# Altium schematic sheet USB2JTAG-Power.SchDoc: =ProjectTitle+'-Power'
size A4; SheetNumber: 3; SheetTotal: 3
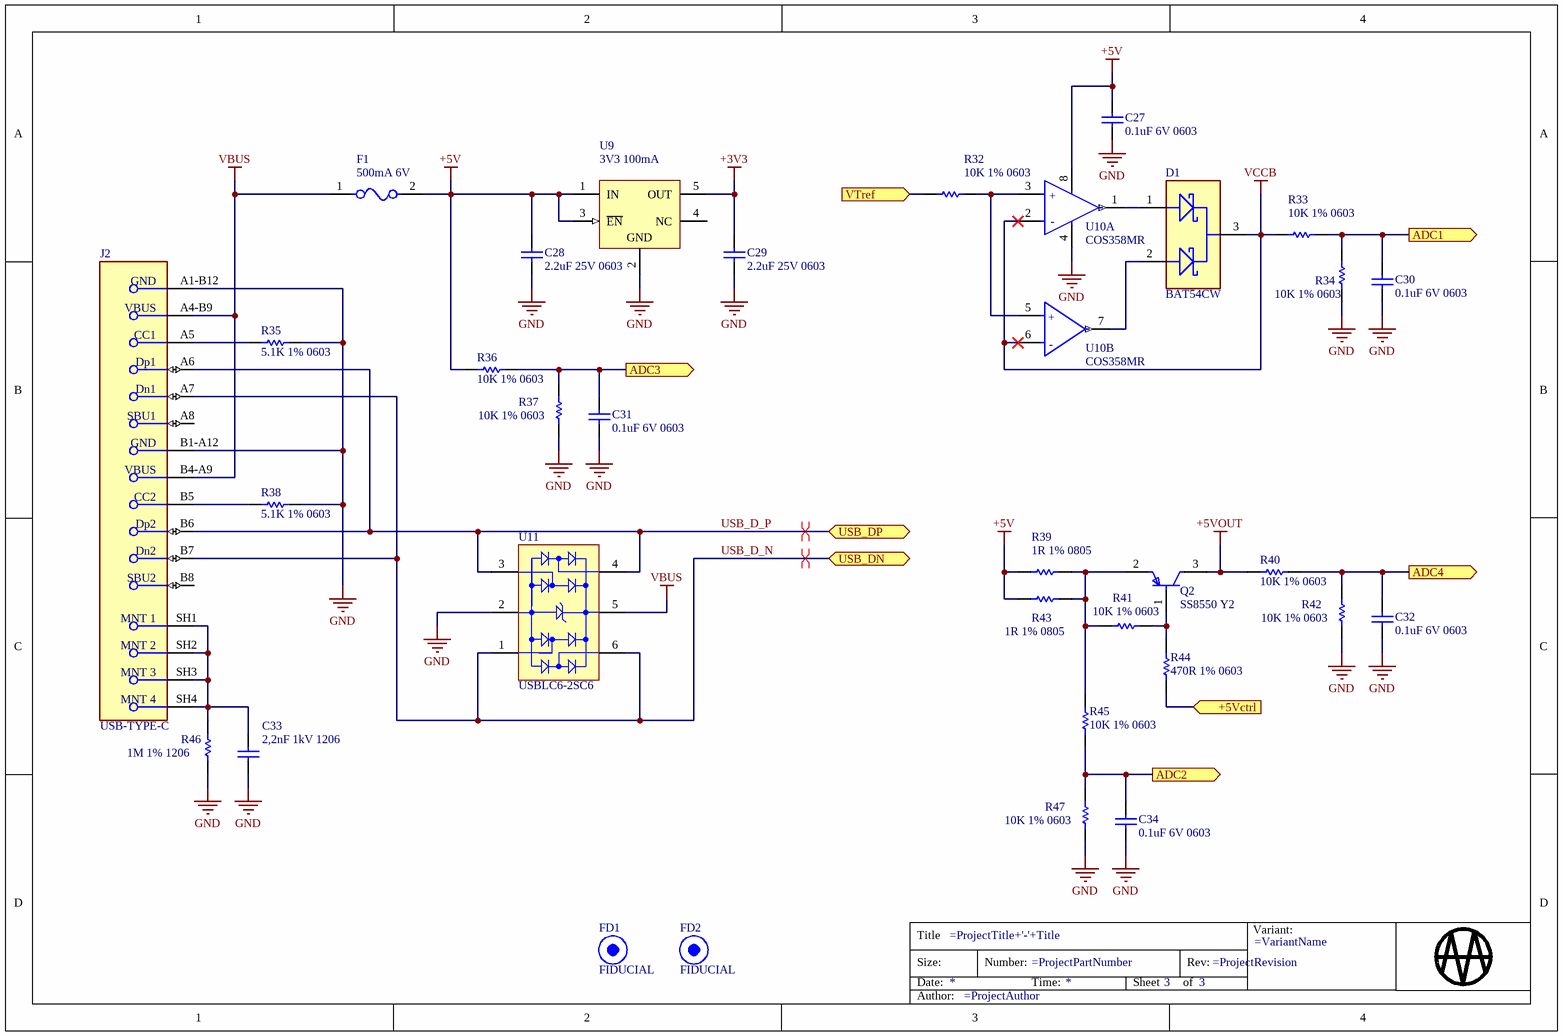
[diagram p0: USB2JTAG-Power.SchDoc]

## Parts
?  Total Sheets: 3  (hidden comment: Title Block Logo)  (graphical)
C27  0.1uF 6V 0603  [FP-GRM188-0_1-e0_2_0_55-IPC_C-NOSILK]
C28  2.2uF 25V 0603  [FP-GRM188-0_1-e0_2_0_55-IPC_C-NOSILK]
C29  2.2uF 25V 0603  [FP-GRM188-0_1-e0_2_0_55-IPC_C-NOSILK]
C30  0.1uF 6V 0603  [FP-GRM188-0_1-e0_2_0_55-IPC_C-NOSILK]
C31  0.1uF 6V 0603  [FP-GRM188-0_1-e0_2_0_55-IPC_C-NOSILK]
C32  0.1uF 6V 0603  [FP-GRM188-0_1-e0_2_0_55-IPC_C-NOSILK]
C33  2,2nF 1kV 1206  [FP-C3216-160-0_2-IPC_B-NOSILK]
C34  0.1uF 6V 0603  [FP-GRM188-0_1-e0_2_0_55-IPC_C-NOSILK]
D1  BAT54CW  [FP-SOT323-IPC_B]
F1  500mA 6V  [FP-0805L-MFG]
FD1  FIDUCIAL  [FIDUCIAL_2MM]  (no BOM)
FD2  FIDUCIAL  [FIDUCIAL_2MM]  (no BOM)
J2  USB-TYPE-C  [KH-TYPE-C-16P-2]
Q2  SS8550 Y2  [FP-SOT-23-IPC_B]
R32  10K 1% 0603  [FP-ERA3A-IPC_C-NOSILK]
R33  10K 1% 0603  [FP-ERA3A-IPC_C-NOSILK]
R34  10K 1% 0603  [FP-ERA3A-IPC_C-NOSILK]
R35  5.1K 1% 0603  [FP-ERA3A-IPC_C-NOSILK]
R36  10K 1% 0603  [FP-ERA3A-IPC_C-NOSILK]
R37  10K 1% 0603  [FP-ERA3A-IPC_C-NOSILK]
R38  5.1K 1% 0603  [FP-ERA3A-IPC_C-NOSILK]
R39  1R 1% 0805  [FP-RC0805-0_6-IPC_B-NOSILK]
R40  10K 1% 0603  [FP-ERA3A-IPC_C-NOSILK]
R41  10K 1% 0603  [FP-ERA3A-IPC_C-NOSILK]
R42  10K 1% 0603  [FP-ERA3A-IPC_C-NOSILK]
R43  1R 1% 0805  [FP-RC0805-0_6-IPC_B-NOSILK]
R44  470R 1% 0603  [FP-ERA3A-IPC_C-NOSILK]
R45  10K 1% 0603  [FP-ERA3A-IPC_C-NOSILK]
R46  1M 1% 1206  [FP-RC1206-IPC_B]
R47  10K 1% 0603  [FP-ERA3A-IPC_C-NOSILK]
U9  3V3 100mA  [DBV0005A_N]
U10  COS358MR  [MSOP-8]  (parts A,B of 2)
U11  USBLC6-2SC6  [STM-SOT23-6L_V]

## Ports
+5Vctrl (in), ADC1 (out), ADC2 (out), ADC3 (out), ADC4 (out), USB_DN (bidir), USB_DP (bidir), VTref (in)

## Nets
+3V3: C29.1 U9.5(OUT)
+5V: C27.1 C28.1 F1.2 R36.2 R39.2 R43.2 U9.1(IN) U9.3(~{EN}) U10.8(V+)
+5VOUT: Q2.3(C) R40.2
GND: C27.2 C28.2 C29.2 C30.2 C31.2 C32.2 C33.2 C34.2 J2.A1-B12(GND) J2.B1-A12(GND) R34.2 R35.1 R37.2 R38.1 R42.2 R46.2 R47.2 U9.2(GND) U10.4(V-) U11.2(GND)
VBUS: F1.1 J2.A4-B9(VBUS) J2.B4-A9(VBUS) U11.5(VBUS)
VCCB: D1.3(COMMON_CATHODE) R33.2 U10.2(IN1-) U10.6(IN2-)
+5Vctrl: R44.1 ; port +5Vctrl
ADC1: C30.1 R33.1 R34.1 ; port ADC1
ADC2: C34.1 R45.1 R47.1 ; port ADC2
ADC3: C31.1 R36.1 R37.1 ; port ADC3
ADC4: C32.1 R40.1 R42.1 ; port ADC4
USB_D_N: J2.A7(Dn1) J2.B7(Dn2) U11.1(I/O_1) U11.6(I/O_4) ; port USB_DN
USB_D_P: J2.A6(Dp1) J2.B6(Dp2) U11.3(I/O_2) U11.4(I/O_3) ; port USB_DP
VTref: R32.2 ; port VTref
NetC33_1: C33.1 J2.SH1 J2.SH2 J2.SH3 J2.SH4 R46.1
NetD1_1: D1.1(1_ANODE) U10.1(OUT1)
NetD1_2: D1.2(2_ANODE) U10.7(OUT2)
NetJ2_A5: J2.A5(CC1) R35.2
NetJ2_B5: J2.B5(CC2) R38.2
NetQ2_1: Q2.1(B) R41.2 R44.2
NetQ2_2: Q2.2(E) R39.1 R41.1 R43.1 R45.2
NetR32_1: R32.1 U10.3(IN1+) U10.5(IN2+)

Not connected (* = marked no-connect by the designer): J2 A8(SBU1) B8(SBU2); U9 4(NC)

## Layout directives
differential pair: USB_D_N, USB_D_P

## Notes on the sheet
- Title
- Size:
- Date:
- A4
- Number:
- Time:
- Revision:
- Sheet
- of
- File:
- (in symbol OPAMP 2 CIRCUIT, part A) +; -
- (in symbol OPAMP 2 CIRCUIT, part B) +; -
- (in symbol Title Block MAA) Variant:; Title; Size:; Number:; Rev:; Date:; Time:; Sheet; of; Author:
- (in symbol USB-TYPE-C) MNT 1; MNT 2; MNT 3; MNT 4

## Library data of the parts
? = Title Block MAA: Sheet Title: =ProjectTitle+'-'+Title; Document Number: =ProjectPartNumber; Revision Number: =ProjectRevision; Organization Address 1: =VariantName; Date: *; Time: *; Document Path and Name: =ProjectAuthor; Sheet Number: 3
C27 C30-C32 C34 = CAP0603: 50V 100nF X7R ±5% 0603 Multilayer Ceramic Capacitors MLCC - SMD/SMT ROHS; Manufacturer: Walsin Tech Corp; Manufacturer Part Number: 0603B104J500CT; Supplier 1: LCSC; Supplier Part Number 1: C119027; Case/Package: 0603
C28 C29 = CAP0603: 25V 2.2uF X7R ±10% 0603 Multilayer Ceramic Capacitors MLCC - SMD/SMT ROHS; Manufacturer: FH(Guangdong Fenghua Advanced Tech); Manufacturer Part Number: 0603B225K250NT; Supplier 1: LCSC; Supplier Part Number 1: C99228; Case/Package: 0603
  C28: ComponentLink1Description: Datasheet; ComponentLink1URL: *
C33 = CAP1206: 1kV 2.2nF X7R ±10% 1206  Multilayer Ceramic Capacitors MLCC - SMD/SMT ROHS; Manufacturer: FH (Guangdong Fenghua Advanced Tech); Manufacturer Part Number: 1206B222K102NT; Supplier 1: LCSC; Supplier Part Number 1: C9191; Case/Package: 1206; ComponentLink1Description: Datasheet; ComponentLink1URL: https://datasheet.lcsc.com/lcsc/1811151146_FH--Guangdong-Fenghua-Advanced-Tech-1206B222K102NT_C9191.pdf
D1 = CMP-12790-000028-1: 30V 1V@100mA 200mA SOT-323(SC-70) Schottky Barrier Diodes (SBD) ROHS; Manufacturer: Jiangsu Changjing Electronics Technology Co., Ltd.; Manufacturer Part Number: BAT54CW; Supplier 1: LCSC; Supplier Part Number 1: C77321; Case/Package: SOT-323; ComponentLink1Description: Datasheet; ComponentLink1URL: https://datasheet.lcsc.com/lcsc/1811122015_Jiangsu-Changjing-Electronics-Technology-Co---Ltd--BAT54CW_C77321.pdf
F1 = CMP-08606-000023-1: 6V 500mA 100A 1A 100ms 0805 Resettable Fuses ROHS; Manufacturer Part Number: SMD0805B050TF; Manufacturer: Brightking; Supplier 1: LCSC; Supplier Part Number 1: C269104; Case/Package: 0805; ComponentLink1Description: Datasheet; ComponentLink1URL: https://datasheet.lcsc.com/lcsc/1808280424_Brightking-SMD0805B050TF_C269104.pdf
J2 = USB-TYPE-C: CONN USB 2.0 TYPE-C R/A SMT; Manufacturer: Shenzhen Kinghelm Elec; Manufacturer Part Number: KH-TYPE-C-16P; Number Of Contacts: 16; ComponentLink2URL: https://datasheet.lcsc.com/lcsc/2009111434_Shenzhen-Kinghelm-Elec-KH-TYPE-C-16P_C709357.pdf; ComponentLink2Description: Datasheet; Supplier 1: LCSC; Supplier Part Number 1: C709357
Q2 = CMP-56214-000002-1: 100nA 25V 300mW 1.5A 200@100mA,1V 100MHz 500mV@800mA,80mA PNP +150℃@(Tj) SOT-23(SOT-23-3) Bipolar Transistors - BJT ROHS; Manufacturer: JCST; Case/Package: SOT-23; Supplier 1: LCSC; Supplier Part Number 1: C8542; Manufacturer Part Number: SS8550 Y2; ComponentLink1Description: datasheet; ComponentLink1URL: https://datasheet.lcsc.com/lcsc/1810161212_Jiangsu-Changjing-Electronics-Technology-Co---Ltd--SS8550-Y2_C8542.pdf
R32-R34 R36 R37 R40-R42 R45 R47 = RES0603: 0.1W ±1% 10kΩ 0603 Chip Resistor - Surface Mount ROHS; Manufacturer: TyoHM; Manufacturer Part Number: RMC 0603 10K F N; Case/Package: 0603; Supplier 1: LCSC; Supplier Part Number 1: C269701
  R34 R41: ComponentLink1Description: Datasheet; ComponentLink1URL: https://datasheet.lcsc.com/lcsc/1811101830_TyoHM-RMC-0603-10K-F-N_C269701.pdf
R35 R38 = RES0603: 100mW Thick Film Resistors 75V ±1% ±100ppm/℃ 5.1kΩ -55℃~+155℃ 0603 Chip Resistor - Surface Mount ROHS; Manufacturer: YAGEO; Manufacturer Part Number: RC0603FR-075K1L; Case/Package: 0603; Supplier 1: LCSC; Supplier Part Number 1: C105580
  R38: ComponentLink1Description: Datasheet; ComponentLink1URL: https://datasheet.lcsc.com/lcsc/1808272258_YAGEO-RC0603FR-075K1L_C105580.pdf
R39 R43 = RES0805: 125mW Thick Film Resistors 150V ±1% ±400ppm/℃ -55℃~+155℃ 1Ω 0805 Chip Resistor - Surface Mount ROHS; Manufacturer Part Number: 0805W8F100KT5E; Manufacturer: UNI-ROYAL(Uniroyal Elec); Supplier 1: LCSC; Supplier Part Number 1: C25271; Case/Package: 0805
  R39: ComponentLink1Description: Datasheet; ComponentLink1URL: https://datasheet.lcsc.com/lcsc/2205311845_UNI-ROYAL-Uniroyal-Elec-0805W8F100KT5E_C25271.pdf
R44 = RES0603: 100mW 75V ±100ppm/℃ ±1% -55℃~+155℃ 470Ω 0603 Chip Resistor - Surface Mount ROHS; Manufacturer: YAGEO; Manufacturer Part Number: RC0603FR-07470RL; Case/Package: 0603; Supplier 1: LCSC; Supplier Part Number 1: C114669; ComponentLink1Description: Datasheet; ComponentLink1URL: https://datasheet.lcsc.com/lcsc/1810161617_YAGEO-RC0603FR-07470RL_C114669.pdf
R46 = RES1206: 250mW Thick Film Resistors 200V ±1% ±100ppm/℃ -55℃~+155℃ 1MΩ 1206 Chip Resistor - Surface Mount ROHS; Manufacturer: YAGEO; Manufacturer Part Number: RC1206FR-071ML; Supplier 1: LCSC; Supplier Part Number 1: C108083; Case/Package: 1206; ComponentLink1Description: Datasheet; ComponentLink1URL: https://datasheet.lcsc.com/lcsc/1808272252_YAGEO-RC1206FR-071ML_C108083.pdf
U9 = CMP-0394-00641-2: 350mA 320mV@(200mA) Fixed 3.3V~3.3V Positive 1 18V SOT-23-5 Linear Voltage Regulators (LDO) ROHS; Manufacturer: MICRONE(Nanjing Micro One Elec); Manufacturer Part Number: ME6215C33M5G; ComponentLink2URL: https://datasheet.lcsc.com/lcsc/1809201023_MICRONE-Nanjing-Micro-One-Elec-ME6215C33M5G_C84119.pdf; ComponentLink2Description: datasheet; Supplier 1: LCSC; Supplier Part Number 1: C84119; Case/Package: SOT-23-5
U10 = OPAMP 2 CIRCUIT: IC OPAMP GP 2 CIRCUIT 8SOIC; Manufacturer: COSINE; Case/Package: MSOP-8; Manufacturer Part Number: COS358MR; Supplier 1: LCSC; Supplier Part Number 1: C693058; ComponentLink1Description: Datasheet; ComponentLink1URL: https://datasheet.lcsc.com/lcsc/2006301914_COSINE-COS358MR_C693058.pdf
U11 = CMP-2000-05378-1: Very low capacitance ESD protection, 3.5 pF, -40 to 125 degC, 6-Pin SOT23, RoHS, Tape and Reel; Manufacturer: STMicroelectronics; Polarity: Uni-Directional; Clamping Voltage: 17V; Rad Hardened: No; Product Height (mm): 1.3mm; Leakage Current (Max): 0.15uA; Product Length (mm): 3.05mm; Number of Elements: 1; Peak Pulse Current: 5A; Configuration: Dual; Reverse Breakdown Voltage: 6V; Working Voltage (Max): 5V; Capacitance Value: 3.5pF; Suppressor Type: DiodeArrays; Product Depth (mm): 1.75mm; Test Current (It): 1mA; Direction: Unidirectional,Bidirectional; Operating Supply Voltage: 1.1V; Number of Channels: 2; Reverse Standoff Voltage: 5.25V; Power Line Protection: Yes; Max Reverse Leakage Current: 150nA; Data Rate: 480Mbps; Package / Case: SOT-23; Operating Temperature Max Deg. C: 125C; Package Description: 6-Pin Small Outline Transistor, Body 2.925 x 1.625 mm, Pitch 0.95 mm; Package Reference: SOT23-6L; Datasheet Version: Rev. 5, 10/2011; Operating Temperature Min Deg. C: -40C; Mounting Style: SurfaceMount; Direction Type: Uni-Directional; Mounting: SurfaceMount; Pin Count: 6; Leakage Current: 0.15uA; Packaging: TapeandReel; Operating Temperature Classification: Automotive; Clamping Voltage (Max): 17V; Manufacturer URL: http://www.st.com/; Reverse Stand-off Voltage: 5V; Datasheet URL: http://www.st.com/st-web-ui/static/active/en/resource/technical/document/datasheet/CD00050750.pdf; Working Voltage: 5V; Operating Temp Range: -40Cto125C; Supplier 1: Rs; Manufacturer Part Number: USBLC6-2SC6; RoHS: Yes; Category: TVS Diodes; Stock 1: 6950; Pricing 1: 10=101,409, 50=95,548, 100=90,505, 250=85,325, 500=81,1 (RUB); Mount: Surface Mount; Case/Package: SOT-23; Number of Pins: 6; Min Operating Temperature: -40°C; Max Operating Temperature: 125°C; Capacitance: 3.5pF; Termination: SMD/SMT; Series: USB; Package Quantity: 3000; Breakdown Voltage: 6V; Number of Bidirectional Channels: 2; Min Breakdown Voltage: 6V; ESD Protection: Yes; Test Current: 1mA; Max Breakdown Voltage: 6V; Clamping Voltage-Max: 17V; Length: 3.05mm; Width: 1.75mm; Height: 1.3mm; Depth: 1.75mm; Radiation Hardening: No; Reach SVHC Compliant: No; Lead Free: Lead Free; RoHS Compliant: Yes; ComponentLink1URL: https://datasheet.ciiva.com/1268/1690354-1268384.pdf?src-supplier=Element14; ComponentLink1Description: https://datasheet.ciiva.com/1268/1690354-1268384.pdf?src-supplier=Element14; ComponentLink2URL: https://datasheet.ciiva.com/4508/cd00050750-113117-4508433.pdf?src-supplier=Mouser; ComponentLink2Description: https://datasheet.ciiva.com/4508/cd00050750-113117-4508433.pdf?src-supplier=Mouser; ComponentLink3URL: https://datasheet.ciiva.com/15143/getdatasheetpartid-148465-15143789.pdf?src-supplier=Verical; ComponentLink3Description: https://datasheet.ciiva.com/15143/getdatasheetpartid-148465-15143789.pdf?src-supplier=Verical; ComponentLink4URL: https://datasheet.ciiva.com/16200/cd00050750-16200026.pdf?src-supplier=Future+Electronics; ComponentLink4Description: https://datasheet.ciiva.com/16200/cd00050750-16200026.pdf?src-supplier=Future+Electronics; ComponentLink5URL: https://datasheet.ciiva.com/41444/001184109-da-01-en-ic-esd-protecti-usblc6-2sc6-sot-23-6-stm-41444156.pdf?src-supplier=Conrad; ComponentLink5Description: https://datasheet.ciiva.com/41444/001184109-da-01-en-ic-esd-protecti-usblc6-2sc6-sot-23-6-stm-41444156.pdf?src-supplier=Conrad; Supplier Part Number 1: C5250994